# EAGLE design Adafruit Trellis 4x4 3mm HT16K33 (EAGLE 6.4)
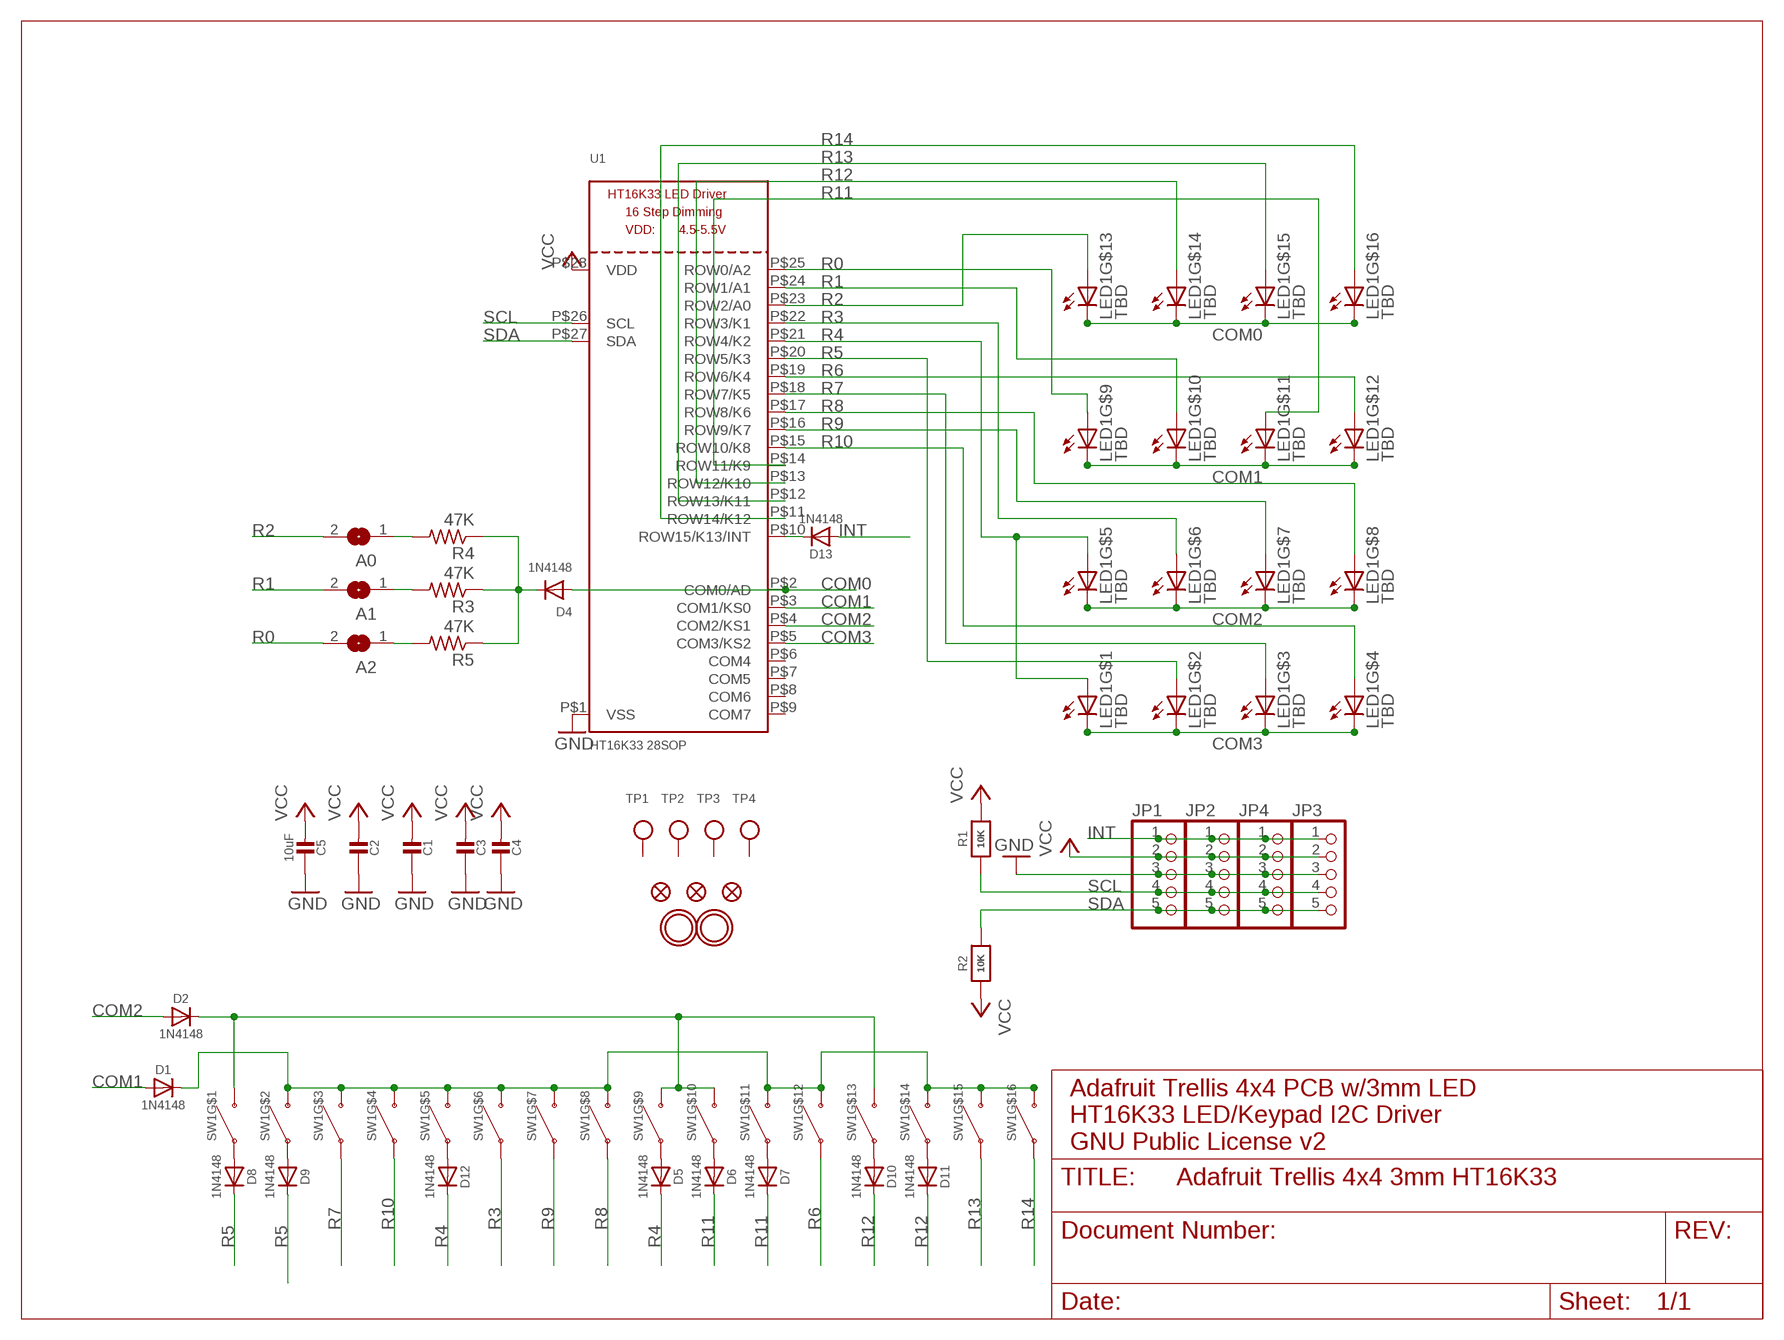
[diagram p0: schematic, sheet 1]

## Parts
A0  SOLDERJUMPERREFLOW_NOPASTE  [SOLDERJUMPER_REFLOW_NOPASTE]
A1  SOLDERJUMPERREFLOW_NOPASTE  [SOLDERJUMPER_REFLOW_NOPASTE]
A2  SOLDERJUMPERREFLOW_NOPASTE  [SOLDERJUMPER_REFLOW_NOPASTE]
C1  CAP_CERAMIC_0805  [_0805]
C2  CAP_CERAMIC_0805  [_0805]
C3  CAP_CERAMIC_0805  [_0805]
C4  CAP_CERAMIC_0805  [_0805]
C5  10uF  CAP_CERAMIC_0805  [_0805]
D1  1N4148  DIODESOD-323  [SOD-323]
D2  1N4148  DIODESOD-323  [SOD-323]
D4  1N4148  DIODESOD-323F  [SOD-323F]
D5  1N4148  DIODESOD-323  [SOD-323]
D6  1N4148  DIODESOD-323  [SOD-323]
D7  1N4148  DIODESOD-323  [SOD-323]
D8  1N4148  DIODESOD-323  [SOD-323]
D9  1N4148  DIODESOD-323  [SOD-323]
D10  1N4148  DIODESOD-323  [SOD-323]
D11  1N4148  DIODESOD-323  [SOD-323]
D12  1N4148  DIODESOD-323  [SOD-323]
D13  1N4148  DIODESOD-323  [SOD-323]
FID1  FIDUCIAL""  [FIDUCIAL_1MM]
FID2  FIDUCIAL""  [FIDUCIAL_1MM]
FID3  FIDUCIAL""  [FIDUCIAL_1MM]
JP1  HEADER-1X5EDGESMT  [1X5_SMT]
JP2  HEADER-1X5EDGESMT  [1X5_SMT]
JP3  HEADER-1X5EDGESMT  [1X5_SMT]
JP4  HEADER-1X5EDGESMT  [1X5_SMT]
LED1  TBD  LED-3MM-4X4GRID-3MM  [LED3MM-4X4GRID]
R1  10K  RESISTOR_0805  [_0805]
R2  10K  RESISTOR_0805  [_0805]
R3  47K  R-US_R0805  [R0805]
R4  47K  R-US_R0805  [R0805]
R5  47K  R-US_R0805  [R0805]
SW1  SWITCH-SILICON-4X4GRID-10MM-5.4MM  [ELAST_PAD_SQUARE_10MM_5.4MM_4X4GRID]
TP1  TESTPOINT  [TESTPOINT_SMT]
TP2  TESTPOINT  [TESTPOINT_SMT]
TP3  TESTPOINT  [TESTPOINT_SMT]
TP4  TESTPOINT  [TESTPOINT_SMT]
U1  HT16K33 28SOP  HT16K33_SOP28  [SOP28_300MIL]
U$1  MOUNTINGHOLE2.5  [MOUNTINGHOLE_2.5_PLATED]
U$2  MOUNTINGHOLE2.5  [MOUNTINGHOLE_2.5_PLATED]

## Nets
COM0: D4.A LED1.K13(C) LED1.K14(C) LED1.K15(C) LED1.K16(C) U1.P$2(COM0/AD)
COM1: D1.A LED1.K9(C) LED1.K10(C) LED1.K11(C) LED1.K12(C) U1.P$3(COM1/KS0)
COM2: D2.A LED1.K5(C) LED1.K6(C) LED1.K7(C) LED1.K8(C) U1.P$4(COM2/KS1)
COM3: LED1.K1(C) LED1.K2(C) LED1.K3(C) LED1.K4(C) U1.P$5(COM3/KS2)
GND: C1.1 C2.1 C3.1 C4.1 C5.1 JP1.3 JP2.3 JP3.3 JP4.3 U1.P$1(VSS)
INT: D13.A JP1.1 JP2.1 JP3.1 JP4.1
N$1: D2.C SW1.B1 SW1.B9 SW1.B10 SW1.B13
N$2: D13.C U1.P$10(ROW15/K13/INT)
N$3: D5.A SW1.A9
N$4: D6.A SW1.A10
N$5: D1.C SW1.B2 SW1.B3 SW1.B4 SW1.B5 SW1.B6 SW1.B7 SW1.B8 SW1.B11 SW1.B12 SW1.B14 SW1.B15 SW1.B16
N$6: D7.A SW1.A11
N$7: D8.A SW1.A1
N$8: D9.A SW1.A2
N$9: A2.1 R5.2
N$10: D10.A SW1.A13
N$11: D11.A SW1.A14
N$12: D12.A SW1.A5
N$16: D4.C R3.1 R4.1 R5.1
N$19: A1.1 R3.2
N$20: A0.1 R4.2
R0: A2.2 LED1.A9(A) U1.P$25(ROW0/A2)
R1: A1.2 LED1.A10(A) U1.P$24(ROW1/A1)
R2: A0.2 LED1.A13(A) U1.P$23(ROW2/A0)
R3: LED1.A6(A) SW1.A6 U1.P$22(ROW3/K1)
R4: D5.C D12.C LED1.A1(A) LED1.A5(A) U1.P$21(ROW4/K2)
R5: D8.C D9.C LED1.A2(A) U1.P$20(ROW5/K3)
R6: LED1.A12(A) SW1.A12 U1.P$19(ROW6/K4)
R7: LED1.A3(A) SW1.A3 U1.P$18(ROW7/K5)
R8: LED1.A8(A) SW1.A8 U1.P$17(ROW8/K6)
R9: LED1.A7(A) SW1.A7 U1.P$16(ROW9/K7)
R10: LED1.A4(A) SW1.A4 U1.P$15(ROW10/K8)
R11: D6.C D7.C LED1.A11(A) U1.P$14(ROW11/K9)
R12: D10.C D11.C LED1.A14(A) U1.P$13(ROW12/K10)
R13: LED1.A15(A) SW1.A15 U1.P$12(ROW13/K11)
R14: LED1.A16(A) SW1.A16 U1.P$11(ROW14/K12)
SCL: JP1.4 JP2.4 JP3.4 JP4.4 R1.1 U1.P$26(SCL)
SDA: JP1.5 JP2.5 JP3.5 JP4.5 R2.2 U1.P$27(SDA)
VCC: C1.2 C2.2 C3.2 C4.2 C5.2 JP1.2 JP2.2 JP3.2 JP4.2 R1.2 R2.1 U1.P$28(VDD)
Unconnected: TP1.P$1 TP2.P$1 TP3.P$1 TP4.P$1 U1.P$6(COM4) U1.P$7(COM5) U1.P$8(COM6) U1.P$9(COM7)

## Notes on the sheet
- Adafruit Trellis 4x4 PCB w/3mm LED
  HT16K33 LED/Keypad I2C Driver
  GNU Public License v2

## Library data of the parts
A0 A1 A2 = microbuilder:SOLDERJUMPER: SMD Solder JUMPER Solder the two pads together to create a connection, or remove the solder to break it. REFLOW - Use this footprint for solder paste and reflow ovens. WAVE - Use this footprint for hand-soldering (larger pads). CLOSED - Has a trace between the two pads to ensure it is closed by default. The trace needs to be cut to disable the jumper, and can be closed again by creating a solder bridge between the two pads.
C1-C5 = microbuilder:CAP_CERAMIC: Ceramic Capacitors For new designs, use the packages preceded by an '_' character since they are more reliable: The following footprints should be used on most boards: _0402 - Standard footprint for regular board layouts _0603 - Standard footprint for regular board layouts _0805 - Standard footprint for regular board layouts _1206 - Standard footprint for regular board layouts For extremely tight-pitch boards where space is at a premium, the following 'micro-pitch' footprints can be used (smaller pads, no silkscreen outline, etc.): _0402MP - Micro-pitch footprint for very dense/compact boards _0603MP - Micro-pitch footprint for very dense/compact boards _0805MP - Micro-pitch footprint for very dense/compact boards _1206MP - Micro-pitch footprint for very dense/compact boards
D1 D2 D5-D13 = microbuilder:DIODE: Diode
D4 = adafruit:DIODE: Diode
FID1-FID3 = microbuilder:FIDUCIAL: Fiducial Alignment Points Various fiducial points for machine vision alignment.; BOM: EXCLUDE
JP1-JP4 = microbuilder:HEADER-1X5: PIN HEADER
LED1 = microbuilder:LED-3MM-4X4GRID
R1 R2 = microbuilder:RESISTOR: Resistors For new designs, use the packages preceded by an '_' character since they are more reliable: The following footprints should be used on most boards: _0402 - Standard footprint for regular board layouts _0603 - Standard footprint for regular board layouts _0805 - Standard footprint for regular board layouts _1206 - Standard footprint for regular board layouts For extremely tight-pitch boards where space is at a premium, the following 'micro-pitch' footprints can be used (smaller pads, no silkscreen outline, etc.): _0402MP - Micro-pitch footprint for very dense/compact boards _0603MP - Micro-pitch footprint for very dense/compact boards _0805MP - Micro-pitch footprint for very dense/compact boards _1206MP - Micro-pitch footprint for very dense/compact boards
R3-R5 = rcl:R-US_: RESISTOR, American symbol
SW1 = microbuilder:SWITCH-SILICON-4X4GRID
TP1-TP4 = microbuilder:TESTPOINT: Test Point Various test points for characterisation and PCB testing TESTPOINT_SMT - Compact Surface Mount Test Point [Digikey: 5016KTR-ND]
U1 = microbuilder:HT16K33_SOP28
U$1 U$2 = microbuilder:MOUNTINGHOLE: Mounting Hole For #2 screws (0.086"/2.18mm width, 0.094"/2.4mm hole) use 2.5mm; BOM: EXCLUDE

## Board
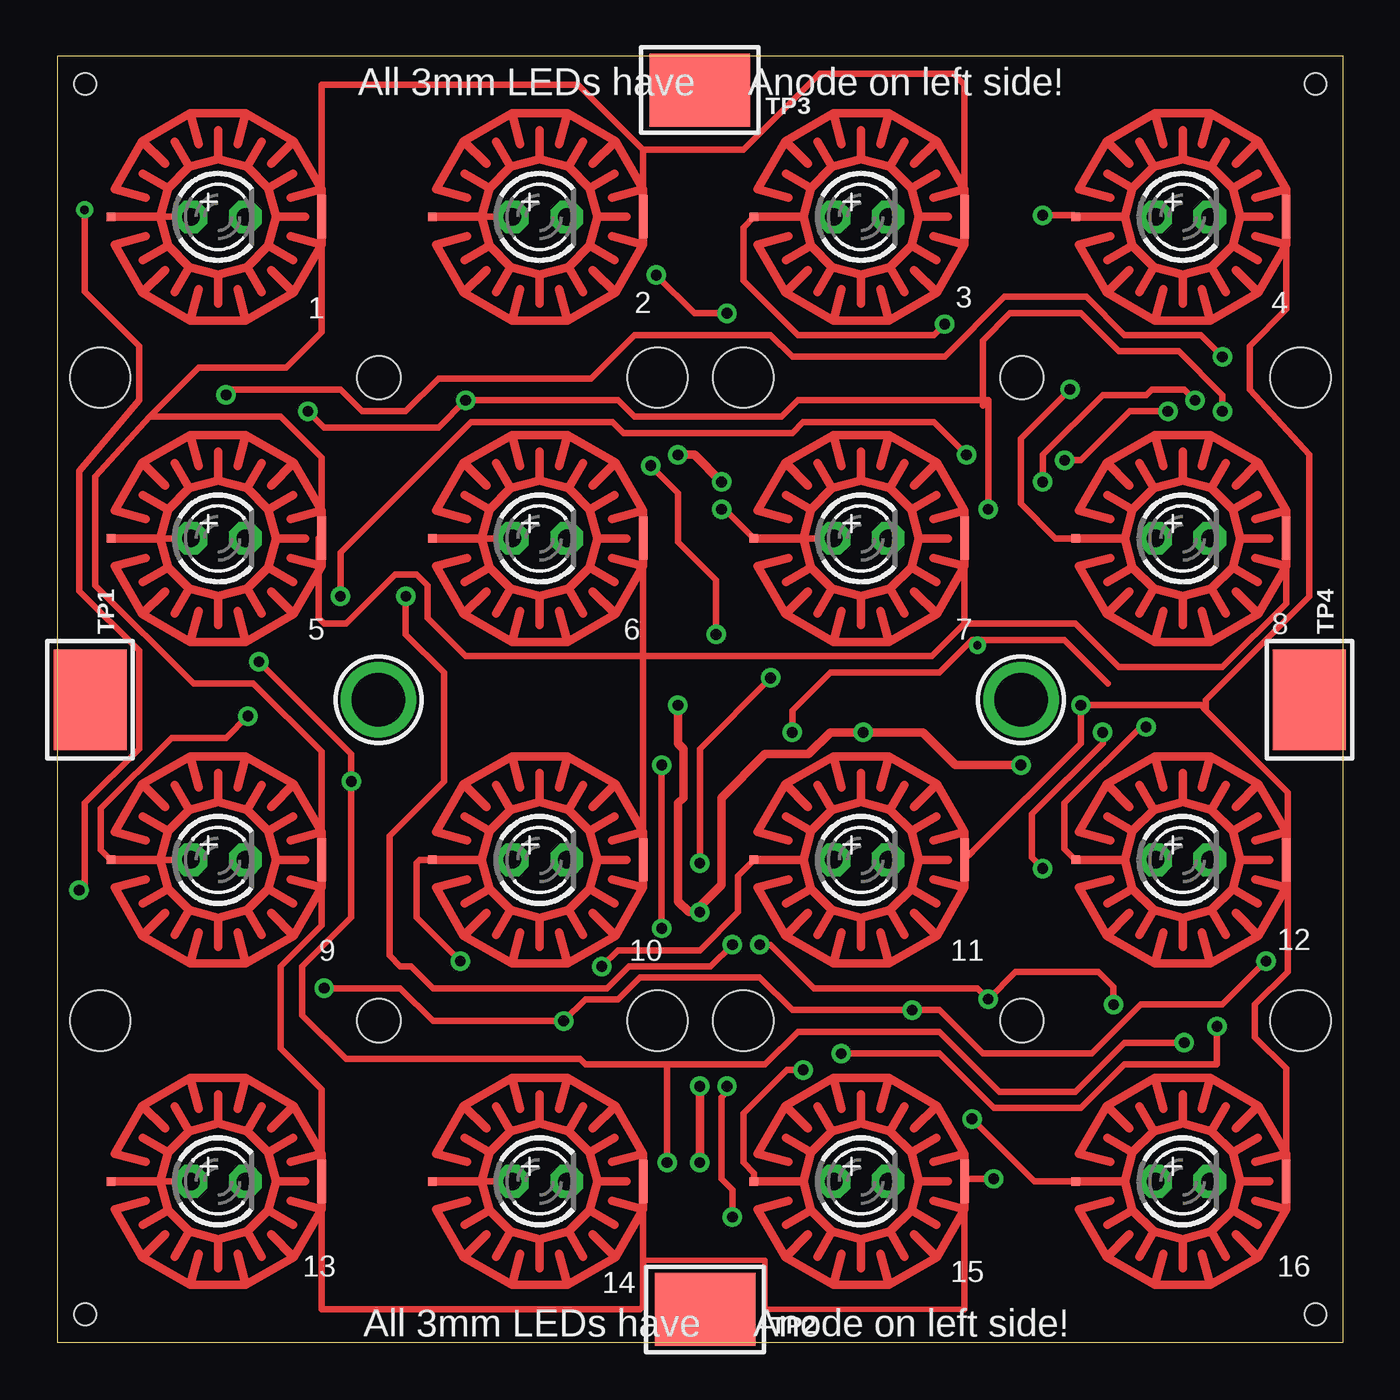
[diagram p1: board, top side]
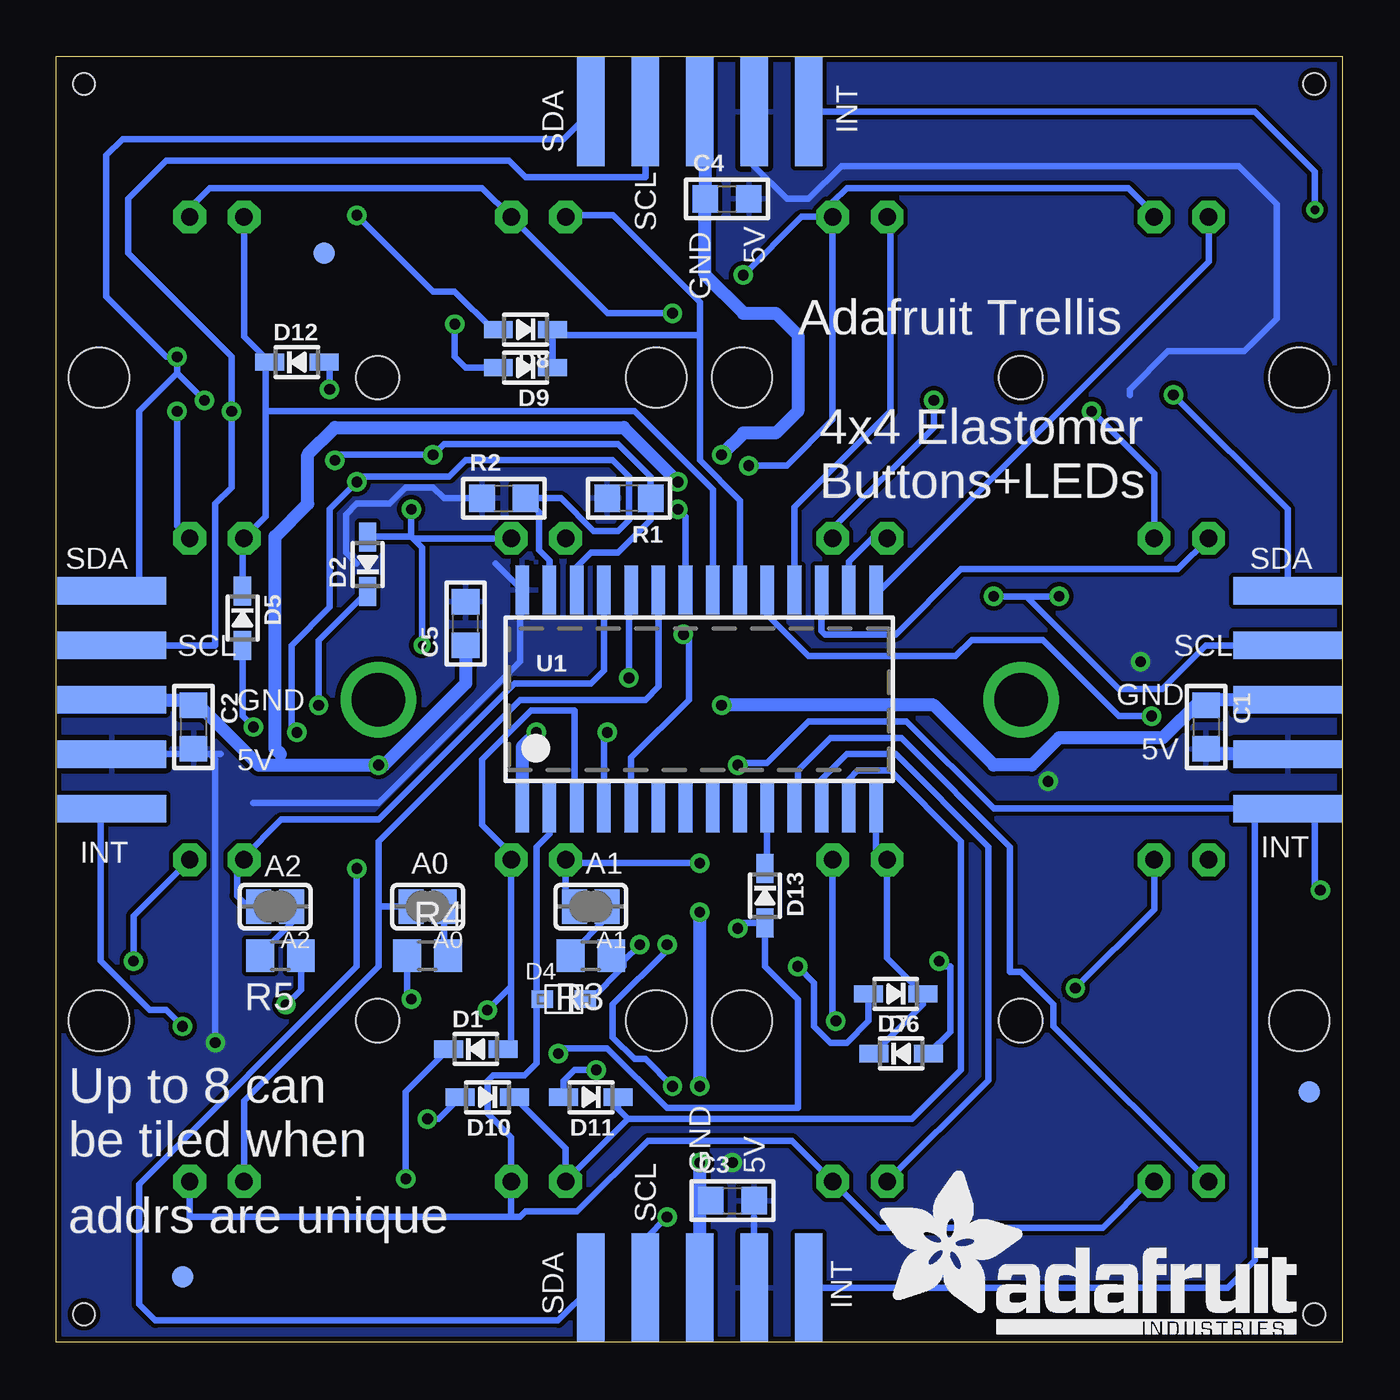
[diagram p2: board, bottom side, seen from below]

Size 60 x 60 mm. Coordinates in mm from the lower left corner, seen from the top.
Outline: 0,0 60,0 60,60 0,60 0,0
Copper layers (1*16): Top 0.035mm / dielectric 1.5mm / Bottom 0.035mm
Design rules "adafruit *": minimum track width 8mil, minimum drill 15.5mil, track to track 8mil, track to pad 8mil, pad to pad 8mil, via to via 8mil, smd to smd 8mil, copper to edge 10mil, drill to drill 8mil, minimum pad ring 10mil, minimum via ring 8mil, stop-mask expansion 4mil, vias tented up to drill 20mil, thermal gap 10mil

### Footprints (pad centres in the part's own frame; a part is rotated, then mirrored left to right if it is on the bottom)
SOLDERJUMPER_REFLOW_NOPASTE = smd 1.168 x 1.6: 1 -0.762,0; 2 0.762,0
_0805 = smd 1.2 x 1.3: 1 -1.016,0; 2 1.016,0
SOD-323 = smd 1.35 x 0.8: A 1.27,0; C -1.27,0
SOD-323F = smd 1 x 0.8: A -1,0; C 1,0
FIDUCIAL_1MM = smd 1 x 1: 1 0,0
1X5_SMT = smd 1.27 x 5.08: 1 -5.08,0; 2 -2.54,0; 3 0,0; 4 2.54,0; 5 5.08,0
LED3MM-4X4GRID = drill 0.813 pad 1.524 octagon: A1 -21.23,-22.5; A2 -6.23,-22.5; A3 8.77,-22.5; A4 23.77,-22.5; A5 -21.23,-7.5; A6 -6.23,-7.5; A7 8.77,-7.5; A8 23.77,-7.5; A9 -21.23,7.5; A10 -6.23,7.5; A11 8.77,7.5; A12 23.77,7.5; A13 -21.23,22.5; A14 -6.23,22.5; A15 8.77,22.5; A16 23.77,22.5; K1 -23.77,-22.5; K2 -8.77,-22.5; K3 6.23,-22.5; K4 21.23,-22.5; K5 -23.77,-7.5; K6 -8.77,-7.5; K7 6.23,-7.5; K8 21.23,-7.5; K9 -23.77,7.5; K10 -8.77,7.5; K11 6.23,7.5; K12 21.23,7.5; K13 -23.77,22.5; K14 -8.77,22.5; K15 6.23,22.5; K16 21.23,22.5
R0805 = smd 1.3 x 1.5: 1 -0.95,0; 2 0.95,0
ELAST_PAD_SQUARE_10MM_5.4MM_4X4GRID = smd 0.4 x 0.4: A1 -17.5,-22.5; A2 -2.5,-22.5; A3 12.5,-22.5; A4 27.5,-22.5; A5 -17.5,-7.5; A6 -2.5,-7.5; A7 12.5,-7.5; A8 27.5,-7.5; A9 -17.5,7.5; A10 -2.5,7.5; A11 12.5,7.5; A12 27.5,7.5; A13 -17.5,22.5; A14 -2.5,22.5; A15 12.5,22.5; A16 27.5,22.5 | smd 0.4 x 2: B1 -27.33,-22.51; B2 -12.33,-22.51; B3 2.67,-22.51; B4 17.67,-22.51; B5 -27.33,-7.51; B6 -12.33,-7.51; B7 2.67,-7.51; B8 17.67,-7.51; B9 -27.33,7.49; B10 -12.33,7.49; B11 2.67,7.49; B12 17.67,7.49; B13 -27.33,22.49; B14 -12.33,22.49; B15 2.67,22.49; B16 17.67,22.49 | hole 2.8: -28,-15; -2,-15; 28,-15; -28,15; -2,15; 2,15; 28,15; 2,-15 | hole 1: -28.7,-28.7; 28.7,-28.7; 28.7,28.7; -28.7,28.7 | hole 2: -15,15; 15,15; 15,-15; -15,-15
TESTPOINT_SMT = smd 4.7 x 3.4: P$1 0,0
SOP28_300MIL = smd 0.635 x 2.286: P$1 -8.255,-5.08; P$2 -6.985,-5.08; P$3 -5.715,-5.08; P$4 -4.445,-5.08; P$5 -3.175,-5.08; P$6 -1.905,-5.08; P$7 -0.635,-5.08; P$8 0.635,-5.08; P$9 1.905,-5.08; P$10 3.175,-5.08; P$11 4.445,-5.08; P$12 5.715,-5.08; P$13 6.985,-5.08; P$14 8.255,-5.08; P$15 8.255,5.08; P$16 6.985,5.08; P$17 5.715,5.08; P$18 4.445,5.08; P$19 3.175,5.08; P$20 1.905,5.08; P$21 0.635,5.08; P$22 -0.635,5.08; P$23 -1.905,5.08; P$24 -3.175,5.08; P$25 -4.445,5.08; P$26 -5.715,5.08; P$27 -6.985,5.08; P$28 -8.255,5.08
MOUNTINGHOLE_2.5_PLATED = drill 2.5 pad 3.2: P$1 0,0

### Placement (x,y rotation side)
A0  42.67,20.32 180 bottom
A1  35.05,20.32 180 bottom
A2  49.78,20.32 180 bottom
C1  6.35,28.7 270 bottom
C2  53.59,28.7 270 bottom
C3  28.45,6.6 0 bottom
C4  28.7,53.34 0 bottom
C5  40.89,33.53 90 bottom
D1  40.42,13.67 0 bottom
D2  45.46,36.29 90 bottom
D4  36.32,16 0 bottom
D5  51.31,33.78 270 bottom
D6  20.83,16.26 180 bottom
D7  20.57,13.46 0 bottom
D8  38.1,47.24 180 bottom
D9  38.1,45.47 180 bottom
D10  39.88,11.43 180 bottom
D11  35.05,11.43 180 bottom
D12  48.77,45.72 0 bottom
D13  26.92,20.83 270 bottom
FID1  54.1,3.05 0 bottom
FID2  1.52,11.68 0 bottom
FID3  47.5,50.8 0 bottom
JP1  57.4,29.97 90 bottom
JP2  2.54,29.97 90 bottom
JP3  29.97,2.54 180 bottom
JP4  29.97,57.4 180 bottom
LED1  30,30 180 top
R1  33.27,39.37 180 bottom
R2  39.12,39.37 0 bottom
R3  35.05,18.03 180 bottom
R4  42.67,18.03 0 bottom
R5  49.53,18.03 180 bottom
SW1  30,30 180 top
TP1  1.52,29.97 90 top
TP2  30.23,1.52 0 top
TP3  29.97,58.42 0 top
TP4  58.42,29.97 90 top
U1  30,30 0 bottom
U$1  14.99,29.97 0 top
U$2  44.96,29.97 0 top
U$3  [ADAFRUIT_TEXT_20MM]  21.72,0.38 0 bottom

### Tracks (layer width: path | path; a pad name or v marks a point on that pad's centre or on a via)
COM0
  Bottom 0.305: LED1.K13 53.77,5.84 38.77,5.84 | 38.77,5.84 LED1.K14 38.77,9.56 39.88,10.67 39.88,12.19 39.62,12.45 38.14,12.45 37.59,13 37.59,16 | 38.77,5.84 38.35,5.84 38.1,6.1 35.69,6.1 32.38,9.4 25.67,9.4 LED1.K15 21.6,5.33 11.18,5.33 9.01,7.5 LED1.K16 | U1.P$2 36.98,23.72 37.59,23.11 37.59,16 | 37.59,16 D4.A
COM1  (via drill 0.5)
  Top 0.305: v12.45,16.51 16,16.51 17.53,14.99 v23.62,14.99 24.64,16 26.16,16 27.18,17.02 32.77,17.02 34.29,15.49 v39.88,15.49 41.15,15.49 43.18,13.46 48.26,13.46 50.55,15.75 54.36,15.75 v56.39,17.78
  Bottom 0.305: LED1.K12 8.77,20.2 12.45,16.52 v12.45,16.51 | v56.39,17.78 56.39,19.88 LED1.K9 | 38.77,16.6 LED1.K10 38.77,22.77 40.13,24.13 40.13,27.18 37.85,29.46 35.81,29.46 35.81,25.02 U1.P$3 | 38.77,16.6 v39.88,15.49 | LED1.K11 23.77,15.13 v23.62,14.99 | D1.A 38.77,14.05 38.77,16.6
COM2  (via drill 0.39, 0.5)
  Top 0.305: 43.43,43.94 34.54,43.94 33.78,43.18 26.92,43.18 26.16,43.94 v19.05,43.94 17.78,42.67 12.45,42.67 v11.68,43.43 | v43.43,38.86 43.43,43.94 | v34.29,28.45 34.29,29.46 36.07,31.24 41.15,31.24 42.67,32.77 42.93,32.77 | 42.93,32.77 46.99,32.77 49.02,30.73 | 43.43,43.94 43.18,43.69 43.18,46.74 44.45,48.01 47.75,48.01 49.53,46.23 52.32,46.23 54.36,44.2 v54.36,43.43 | v42.93,32.51 42.93,32.77
  Bottom 0.305: LED1.K8 8.77,40.52 v11.68,43.43 | v54.36,43.43 54.36,38.09 LED1.K5 | LED1.K6 43.34,37.5 | 43.34,37.5 43.43,37.59 | 43.43,37.59 v43.43,38.86 | U1.P$4 34.45,28.29 v34.29,28.45 | D2.A 45.43,37.59 43.43,37.59 | v19.05,43.94 19.05,42.67 23.77,37.95 LED1.K7 | 43.34,37.5 42.93,37.08 v42.93,32.51
COM3  (via drill 0.5)
  Top 0.305: v30.73,33.02 30.73,35.56 28.96,37.34 28.96,39.62 v27.69,40.89 | v27.94,49.78 29.72,48.01 v31.24,48.01
  Bottom 0.305: LED1.K4 8.64,52.5 9.98,53.85 23.11,53.85 23.77,53.19 LED1.K3 | U1.P$5 33.18,27.28 30.48,29.97 30.48,32.77 v30.73,33.02 | v27.69,40.89 25.91,40.89 23.77,43.03 LED1.K3 | LED1.K1 53.77,52.91 52.83,53.85 40.12,53.85 LED1.K2 34.28,48.01 v31.24,48.01 | v27.94,49.78 25.22,52.5 LED1.K3
GND  (via drill 0.5)
  Top 0.406: v44.96,26.92 41.91,26.92 40.39,28.45 v37.59,28.45 36.07,28.45 35.05,27.43 33.02,27.43 30.99,25.4 30.99,21.34 29.97,20.32 v29.97,20.07 29.46,20.07 28.96,20.57 28.96,25.15 29.21,25.4 29.21,27.69 28.96,27.94 v28.96,29.72 | v29.97,8.38 v29.97,11.94 | v30.99,40.13 29.72,41.4 v28.96,41.4
  Bottom 0.305: 29.72,57.15 JP4.3 | 6.35,29.97 6.6,29.97
  Bottom 0.406: 49.53,26.92 49.53,27.43
  Bottom 0.61: JP1.3 53.85,29.97 | v37.59,28.45 38.26,27.79 U1.P$1 | JP3.3 29.97,6.86 | 29.97,6.86 v29.97,8.38 | v29.97,11.94 v29.97,20.07 | 49.53,27.43 49.78,27.69 49.78,37.59 48.26,39.12 48.26,41.4 46.99,42.67 33.53,42.67 v30.99,40.13 | JP2.3 6.35,29.97 C1.1 | 6.6,29.97 8.38,28.19 13.21,28.19 14.48,26.92 16.26,26.92 19.05,29.72 v28.96,29.72 | 53.85,29.97 53.59,29.97 50.55,26.92 49.53,26.92 v44.96,26.92 44.7,26.92 40.89,30.73 C5.1 | 53.85,29.97 C2.1 | 29.72,57.15 C4.1 29.72,49.78 27.94,48.01 26.42,48.01 25.4,46.99 25.4,43.43 26.42,42.42 27.94,42.42 v28.96,41.4 | C3.1 29.72,6.6 29.97,6.86
INT  (via drill 0.39, 0.5)
  Top 0.305: v36.58,13.46 41.15,13.46 43.69,10.92 47.75,10.92 49.78,12.95 54.1,12.95 v54.1,14.73 | v28.19,26.92 v28.19,19.3 | v1.02,21.08 1.27,21.34 1.27,25.15 3.81,27.69 3.81,32.26 1.02,35.05 1.02,40.64 3.81,43.94 3.81,46.48 1.27,49.02 v1.27,52.83
  Bottom 0.305: JP1.1 57.91,24.38 57.91,17.78 55.63,15.49 54.86,15.49 v54.1,14.73 | v36.58,13.46 36.32,13.72 34.29,13.72 31.5,10.92 25.4,10.92 25.4,16 26.92,17.53 D13.A 27.94,19.56 v28.19,19.3 | 4.06,24.89 JP2.1 1.27,24.89 1.27,21.34 v1.02,21.08 | 4.06,24.89 16.26,24.89 20.32,28.96 24.89,28.96 26.83,27.02 28.1,27.02 v28.19,26.92 | JP3.1 5.33,2.54 4.06,3.81 4.06,24.89 | JP4.1 4.06,57.4 1.27,54.61 v1.27,52.83
N$1  (via drill 0.5)
  Top 0.305: SW1.B13 57.33,12.77 55.88,14.22 55.88,15.75 57.4,17.27 57.4,22.44 SW1.B9 57.4,22.51 57.4,25.65 53.59,29.46 | 42.33,22.77 SW1.B10 42.67,22.85 42.67,22.86 47.75,27.94 v47.75,29.72 53.34,29.72 53.59,29.46 | SW1.B1 57.33,48.19 55.63,46.48 55.63,44.45 58.42,41.4 58.42,34.8 53.59,29.97 53.59,29.46
  Bottom 0.305: D2.C 47.75,32.73 v47.75,29.72
N$2
  Bottom 0.305: U1.P$10 26.83,22.1 | 26.83,22.1 26.83,21.94 | D13.C 26.83,22.1
N$3  (via drill 0.5)
  Top 0.305: v50.8,28.7 50.55,28.7 46.99,25.15 46.99,23.01 SW1.A9
  Bottom 0.305: D5.A 51.31,29.21 v50.8,28.7
N$4  (via drill 0.5)
  Top 0.305: SW1.A10 31.75,21.75 31.75,20.07 29.97,18.29 26.16,18.29 v25.4,17.53
  Bottom 0.305: v25.4,17.53 24.64,16.76 24.64,14.73 23.88,13.97 23.11,13.97 22.1,14.99 D6.A
N$5  (via drill 0.5)
  Top 0.254: 42.33,1.52 33.02,1.52 33.02,3.81 27.33,3.81
  Top 0.305: SW1.B15 27.33,3.81 27.33,1.68 27.18,1.52 12.33,1.52 SW1.B16 12.33,11.8 10.41,13.72 10.41,17.53 12.33,19.44 SW1.B12 12.33,27.55 9.14,30.73 6.35,30.73 1.78,35.31 1.78,40.39 4.32,43.18 | 42.33,1.52 SW1.B14 42.44,7.62 v43.69,7.62 | SW1.B2 42.33,58.67 41.82,59.18 35.56,59.18 32,55.63 27.33,55.63 | SW1.B7 27.33,32 | 27.33,32 40.81,32 42.33,33.53 | SW1.B6 42.33,33.53 | SW1.B11 27.33,32 | 4.32,43.18 6.6,45.47 10.67,45.47 12.33,47.13 SW1.B4 12.33,58.67 24.28,58.67 27.33,55.63 | SW1.B5 57.33,34.47 54.36,31.5 49.53,31.5 47.5,33.53 42.33,33.53 | 27.33,32 19.05,32 17.27,33.78 17.27,35.31 16.76,35.81 15.75,35.81 13.46,33.53 12.45,33.53 12.19,33.78 12.19,37.51 SW1.B8 12.33,41.26 10.41,43.18 4.32,43.18 | 27.33,55.63 SW1.B3
  Bottom 0.305: D1.C 43.69,11.67 v43.69,7.62
N$6  (via drill 0.5)
  Top 0.305: v18.8,17.78 16.76,19.81 16.76,22.35 16.91,22.5 SW1.A11
  Bottom 0.305: D7.A 18.29,14.48 18.29,17.53 18.8,17.53 v18.8,17.78
N$7  (via drill 0.5)
  Top 0.305: v45.97,52.58 47.42,52.58 SW1.A1
  Bottom 0.305: D8.A 39.62,47.24 41.4,49.02 42.42,49.02 v45.97,52.58
N$8  (via drill 0.5)
  Top 0.305: SW1.A2 32,52 32,49.53 34.54,46.99 40.89,46.99 v41.4,47.5
  Bottom 0.305: v41.4,47.5 41.4,45.97 40.89,45.47 D9.A
N$9
  Bottom 0.305: R5.2 50.48,18.1 49.02,19.56 A2.1
N$10  (via drill 0.5)
  Top 0.305: v42.67,10.41 45.59,7.5 SW1.A13
  Bottom 0.305: D10.A 42.16,10.41 v42.67,10.41
N$11  (via drill 0.5)
  Top 0.305: v34.8,12.7 34.04,12.7 32,10.67 32,8.38 32.5,7.89 SW1.A14
  Bottom 0.305: D11.A 36.32,12.19 35.81,12.7 v34.8,12.7
N$12  (via drill 0.5)
  Top 0.305: v47.24,44.45 44.96,42.16 44.96,39.12 46.57,37.5 SW1.A5
  Bottom 0.305: D12.A 47.24,45.72 v47.24,44.45
N$16  (via drill 0.5)
  Top 0.305: v49.28,15.75 49.28,16.58 48.58,17.27 44.7,17.27 v43.43,16 42.93,16.51 35.31,16.51 33.27,18.54 v32.77,18.54
  Bottom 0.305: R3.1 34.04,18.1 33.85,18.1 33.53,17.78 | D4.C 35.05,16 33.53,17.53 33.53,17.78 | R4.1 43.62,16.19 v43.43,16 | v49.28,15.75 48.58,16.44 R5.1 | 33.53,17.78 v32.77,18.54
N$19
  Bottom 0.305: R3.2 36,18.1 34.29,19.81 A1.1
N$20
  Bottom 0.305: 41.72,18.22 R4.2 41.91,18.22 A0.1
R0
  Bottom 0.305: U1.P$25 34.45,31.34 35.05,30.73 38.61,30.73 44.96,24.38 49.5,24.38 51.31,22.58 LED1.A9 51.56,22.17 51.56,20.83 50.55,19.81 A2.2
R1  (via drill 0.5)
  Top 0.305: v29.97,22.35 29.97,27.69 v33.27,30.99
  Bottom 0.305: v29.97,22.35 36.23,22.35 LED1.A10 36.23,20.74 A1.2 | v33.27,30.99 33.27,34.98 U1.P$24
R2
  Bottom 0.305: U1.P$23 31.91,30.58 32.51,29.97 38.35,29.97 44.96,23.37 44.96,20.32 | 44.96,20.32 44.96,17.53 51.23,11.25 LED1.A13 | A0.2 44.96,20.32
R3  (via drill 0.5)
  Top 0.305: LED1.A6 SW1.A6 30.99,39.01 v30.99,38.86
  Bottom 0.305: U1.P$22 30.64,38.51 v30.99,38.86
R4
  Bottom 0.305: U1.P$21 29.37,39.78 33.02,43.43 50.21,43.43 | D5.C 51.31,37.42 LED1.A5 50.21,38.52 50.21,43.43 | 50.21,43.43 50.21,45.54 D12.C 51.23,46.91 LED1.A1
R5
  Bottom 0.305: U1.P$20 28.1,39.27 29.97,41.15 29.97,46.99 | 29.97,46.99 29.97,48.53 34.02,52.58 36.15,52.58 LED1.A2 | D8.C 36.83,46.99 | 36.83,46.99 D9.C | 29.97,46.99 36.83,46.99
R6  (via drill 0.5)
  Top 0.305: LED1.A12 SW1.A12 2.03,22.97 2.03,24.89 5.33,28.19 7.87,28.19 v8.89,29.21
  Bottom 0.305: U1.P$19 26.83,33.94 24.89,32 18.03,32 17.27,32.77 13.97,32.77 10.41,29.21 v8.89,29.21 | 6.1,22.63 LED1.A12
R7
  Top 0.305: SW1.A3 LED1.A3
  Bottom 0.305: U1.P$18 25.55,38.96 21.08,43.43 21.08,52.35 LED1.A3
R8
  Top 0.305: SW1.A8 LED1.A8
  Bottom 0.305: 24.29,33.43 U1.P$17 24.29,33.18 24.13,33.02 20.83,33.02 17.78,36.07 7.66,36.07 LED1.A8
R9
  Top 0.305: SW1.A7 LED1.A7
  Bottom 0.305: U1.P$16 23.02,36.42 21.84,37.59 21.32,37.59 LED1.A7
R10
  Top 0.305: SW1.A4 LED1.A4
  Bottom 0.305: LED1.A4 6.23,50.41 21.59,35.05 21.72,35.05 U1.P$15
R11
  Bottom 0.305: U1.P$14 21.75,23.02 LED1.A11 21.23,17.93 D6.C 19.56,15.75 D7.C
R12
  Bottom 0.305: U1.P$13 23.02,26.26 22.61,26.67 21.08,26.67 17.78,23.37 17.78,12.7 20.07,10.41 33.32,10.41 | 33.32,10.41 LED1.A14 36.23,9.05 D10.C | D11.C 33.78,10.88 33.32,10.41
R13
  Top 0.305: SW1.A15 LED1.A15
  Bottom 0.305: U1.P$12 24.29,26.26 23.11,27.43 20.83,27.43 16.51,23.11 16.51,12.22 LED1.A15
R14
  Top 0.305: SW1.A16 LED1.A16
  Bottom 0.305: U1.P$11 25.4,25.08 25.4,26.67 23.88,28.19 20.57,28.19 15.49,23.11 15.49,17.27 14.99,17.27 13.46,15.75 13.46,14.73 LED1.A16
SCL  (via drill 0.5)
  Top 0.305: v46.99,41.15 47.75,41.15 50.04,43.43 v51.82,43.43 | v13.21,34.8 13.21,36.83 19.3,42.93 25.91,42.93 26.42,42.42 34.29,42.42 34.8,42.93 40.89,42.93 v42.42,41.4 | v16.26,34.8 16.26,33.02 18.03,31.24 18.03,26.16 15.49,23.62 15.49,18.03 16,17.53 16.51,17.53 17.53,16.51 25.65,16.51 26.67,17.53 30.48,17.53 v31.5,18.54 | v31.5,5.84 31.5,7.11 30.99,7.62 30.99,11.43 31.24,11.68 v31.24,11.94
  Bottom 0.305: JP1.4 52.58,32.51 52.58,39.12 51.82,39.88 v51.82,43.43 51.82,45.97 56.64,50.8 56.64,53.34 54.86,55.12 38.86,55.12 38.1,54.36 32.51,54.36 JP4.4 | U1.P$26 35.72,36.17 35.05,36.83 33.78,36.83 32.26,38.35 R1.1 32.26,40.39 33.78,41.91 41.91,41.91 v42.42,41.4 46.74,41.4 v46.99,41.15 | v13.21,34.8 14.73,34.8 | 14.73,34.8 v16.26,34.8 | JP3.4 32.51,4.83 v31.5,5.84 | v31.24,11.94 32.51,13.21 33.02,13.21 34.04,14.22 34.04,15.75 31.5,18.29 v31.5,18.54 | JP2.4 6.35,32.51 8.38,30.48 10.41,30.48 14.73,34.8
SDA  (via drill 0.5)
  Top 0.305: v45.97,40.13 45.97,41.4 48.77,44.2 50.8,44.2 51.05,44.45 52.58,44.45 v53.09,43.94 | v7.87,44.2 8.13,44.45 13.21,44.45 14.22,43.43 16.26,43.43 17.78,44.96 24.89,44.96 26.92,46.99 33.27,46.99 34.29,45.97 41.4,45.97 44.2,48.77 48.01,48.77 49.78,46.99 53.34,46.99 v54.36,45.97 | v45.97,22.1 45.47,22.61 45.47,24.64 48.77,27.94 v48.77,28.45
  Bottom 0.305: JP1.5 56.13,35.05 56.13,43.43 54.36,45.21 | U1.P$27 36.98,36.48 37.47,36.96 37.47,38.73 R2.2 36.45,39.37 34.93,37.85 33.78,37.85 33.27,38.35 33.27,40.39 34.04,41.15 40.89,41.15 41.66,40.39 45.72,40.39 v45.97,40.13 47.24,38.86 47.24,34.29 49.02,32.51 49.02,28.7 v48.77,28.45 | JP2.5 2.54,38.86 v7.87,44.2 | JP3.5 36.58,1.02 55.37,1.02 56.13,1.78 56.13,7.37 45.97,17.53 v45.97,22.1 | JP4.5 36.32,56.13 56.9,56.13 57.66,55.37 57.66,48.77 54.86,45.97 v54.36,45.97 54.36,45.21 | v53.09,43.94 54.36,45.21
VCC  (via drill 0.5)
  Top 0.305: 28.45,12.95 24.64,12.95 24.38,13.21 13.46,13.21 11.43,15.24 11.43,17.53 13.72,19.81 v13.72,26.16 13.72,27.43 v9.4,31.75 | v52.58,13.97 49.78,13.97 47.5,11.68 43.94,11.68 41.15,14.48 34.54,14.48 33.02,12.95 28.45,12.95 | v28.45,8.38 28.45,12.95
  Bottom 0.305: JP1.2 52.83,27.43 | 52.83,27.43 52.32,27.43 | 50.8,25.15 44.96,25.15 38.35,31.75 38.35,34.98 U1.P$28 39.5,36.32 | v52.58,13.97 52.58,27.18 52.83,27.43 | JP3.2 27.43,5.84 | JP4.2 27.43,54.86 25.91,53.34 24.89,53.34 23.37,54.86 4.83,54.86 3.05,53.09 3.05,47.75 4.57,46.23 8.13,46.23 9.91,44.45 9.91,44.2 | R2.1 41.91,39.37 42.42,39.88 43.69,39.88 44.45,39.12 45.97,39.12 46.48,38.61 46.48,36.83 45.97,36.32 | R1.2 34.29,39.88
  Bottom 0.61: JP2.2 6.1,27.43 6.1,27.69
  pour Bottom: -0.76,60.2 -0.76,-0.25 60.45,-0.25 60.45,60.2

### Text on the board
tPlace: All 3mm LEDs have Anode on left side! | 1 | 2 | 3 | 4 | 5 | 6 | 7 | 8 | 9 | 10 | 11 | 12 | 13 | 15 | 16 | 14 | All 3mm LEDs have Anode on left side!
bPlace: SDA | INT | SCL | 5V | GND | Adafruit Trellis | 4x4 Elastomer / Buttons+LEDs | SDA | SDA | SCL | SCL | GND | GND | 5V | 5V | INT | INT | A1 | A0 | A2 | Up to 8 can / be tiled when | 5V | GND | SCL | addrs are unique | INT | SDA